# Altium schematic sheet Connectors.SchDoc
size A; SheetNumber: 2; SheetTotal: 3
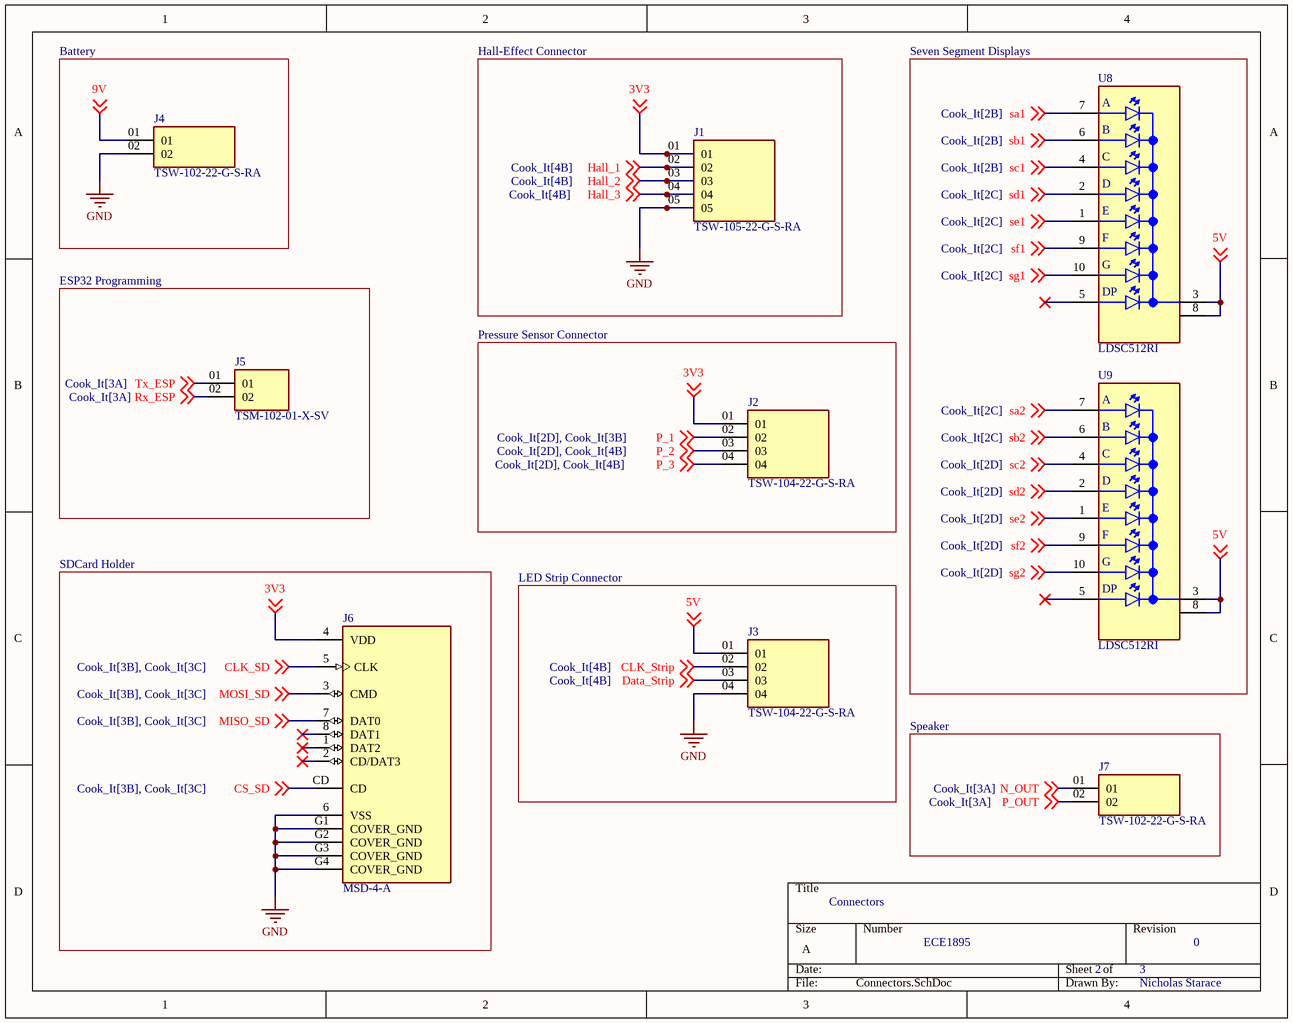
[diagram p0: Connectors.SchDoc]

## Parts
J1  TSW-105-22-G-S-RA  [SAMTEC_TSW-105-22-G-S-RA]
J2  TSW-104-22-G-S-RA  [SAMTEC_TSW-104-22-G-S-RA]
J3  TSW-104-22-G-S-RA  [SAMTEC_TSW-104-22-G-S-RA]
J4  TSW-102-22-G-S-RA  [SAMTEC_TSW-102-22-G-S-RA]
J5  TSM-102-01-X-SV  [SAMTEC_TSM-102-01-X-SV]
J6  MSD-4-A  [CUI_MSD-4-A]
J7  TSW-102-22-G-S-RA  [SAMTEC_TSW-102-22-G-S-RA]
U8  LDSC512RI  [LED_LDSC512RI]
U9  LDSC512RI  [LED_LDSC512RI]

## Blocks framed on the sheet
Battery: J4
Hall-Effect Connector: J1
Seven Segment Displays: U8 U9
ESP32 Programming: J5
Pressure Sensor Connector: J2
SDCard Holder: J6
LED Strip Connector: J3
Speaker: J7

## Nets
GND: J1.05 J3.04 J4.02 J6.6(VSS) J6.G1(COVER_GND) J6.G2(COVER_GND) J6.G3(COVER_GND) J6.G4(COVER_GND)
3V3: J1.01 J2.01 J6.4(VDD) ; off-sheet 3V3
5V: J3.01 U8.3(CC) U8.8(CC) U9.3(CC) U9.8(CC) ; off-sheet 5V
9V: J4.01 ; off-sheet 9V
CLK_SD: J6.5(CLK) ; off-sheet CLK_SD
CLK_Strip: J3.02 ; off-sheet CLK_Strip
CS_SD: J6.CD ; off-sheet CS_SD
Data_Strip: J3.03 ; off-sheet Data_Strip
Hall_1: J1.02 ; off-sheet Hall_1
Hall_2: J1.03 ; off-sheet Hall_2
Hall_3: J1.04 ; off-sheet Hall_3
MISO_SD: J6.7(DAT0) ; off-sheet MISO_SD
MOSI_SD: J6.3(CMD) ; off-sheet MOSI_SD
N_OUT: J7.01 ; off-sheet N_OUT
P_1: J2.02 ; off-sheet P_1
P_2: J2.03 ; off-sheet P_2
P_3: J2.04 ; off-sheet P_3
P_OUT: J7.02 ; off-sheet P_OUT
Rx_ESP: J5.02 ; off-sheet Rx_ESP
sa1: U8.7(A) ; off-sheet sa1
sa2: U9.7(A) ; off-sheet sa2
sb1: U8.6(B) ; off-sheet sb1
sb2: U9.6(B) ; off-sheet sb2
sc1: U8.4(C) ; off-sheet sc1
sc2: U9.4(C) ; off-sheet sc2
sd1: U8.2(D) ; off-sheet sd1
sd2: U9.2(D) ; off-sheet sd2
se1: U8.1(E) ; off-sheet se1
se2: U9.1(E) ; off-sheet se2
sf1: U8.9(F) ; off-sheet sf1
sf2: U9.9(F) ; off-sheet sf2
sg1: U8.10(G) ; off-sheet sg1
sg2: U9.10(G) ; off-sheet sg2
Tx_ESP: J5.01 ; off-sheet Tx_ESP

Not connected (* = marked no-connect by the designer): J6 1(DAT2)* 2(CD/DAT3)* 8(DAT1)*; U8 5(DP)*; U9 5(DP)*

## Notes on the sheet
- Connectors
- ECE1895
- 2
- 3
- 0
- Nicholas Starace

## Library data of the parts
J1 = TSW-105-22-G-S-RA: Conn Unshrouded Header HDR 5 POS 2.54mm Solder RA Side Entry Thru-Hole Bulk; MF: Samtec; Price: None; Value: *; Purchase-URL: https://pricing.snapeda.com/search/part/TSW-105-22-G-S-RA/?ref=eda; Check_prices: https://www.snapeda.com/parts/TSW-105-22-G-S-RA/Samtec/view-part/?ref=eda; Package: None; Availability: In Stock; SnapEDA_Link: https://www.snapeda.com/parts/TSW-105-22-G-S-RA/Samtec/view-part/?ref=snap; MP: TSW-105-22-G-S-RA
J2 J3 = TSW-104-22-G-S-RA: MF: Samtec; Price: None; Value: *; Package: None; Availability: Unavailable; MP: TSW-104-22-G-S-RA
J4 J7 = TSW-102-22-G-S-RA: MF: Samtec; MP: TSW-102-22-G-S-RA; Value: *; Availability: Unavailable; Package: None; Price: None
J5 = TSM-102-01-X-SV: TSM - Samtec 2.54mm Single Row Vertical Surface Mount Header 5.84mm Post Height (01) - Fast Stock; MP: TSM-102-01-L-SV; SnapEDA_Link: https://www.snapeda.com/parts/TSM-102-01-L-SV/Samtec+Inc./view-part/?ref=snap; Package: None; Value: *; MF: Samtec; Check_prices: https://www.snapeda.com/parts/TSM-102-01-L-SV/Samtec+Inc./view-part/?ref=eda
J6 = MSD-4-A: Micro SD Card Connector, 9 Positions, Connector and Ejector, Push In, Auto Eject Out, Surface Mount, 1.8 mm Height Above Board, Gold Flash; MF: Same Sky; SnapEDA_Link: https://www.snapeda.com/parts/MSD-4-A/Same+Sky/view-part/?ref=snap; Package: None; Value: *; MP: MSD-4-A; Check_prices: https://www.snapeda.com/parts/MSD-4-A/Same+Sky/view-part/?ref=eda
U8 U9 = LDSC512RI: .56IN. 7 SEGMENT SINGLE DISPLAY, 565NM GREEN, GRAY FACE, WHITE SEGMENTS, COMMON | Lumex LDS-C512RI; SnapEDA_Link: https://www.snapeda.com/parts/LDS-C512RI/Lumex/view-part/?ref=snap; Package: None; Value: *; MF: Lumex; MP: LDS-C512RI; Check_prices: https://www.snapeda.com/parts/LDS-C512RI/Lumex/view-part/?ref=eda